# Altium schematic sheet StepperLogic.SchDoc
size B
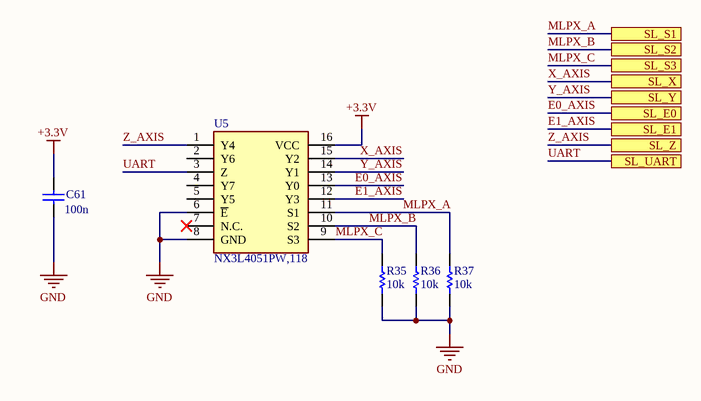
[diagram p0: StepperLogic.SchDoc]

## Parts
C61  value 100n  [RAD-0.3]  (hidden comment: X5R)
R35  value 10k  [AXIAL-0.3]  (hidden comment: Res1)
R36  value 10k  [AXIAL-0.3]  (hidden comment: Res1)
R37  value 10k  [AXIAL-0.3]  (hidden comment: Res1)
U5  NX3L4051PW,118  [SOP65P640X110-16N]

## Ports
SL_E0, SL_E1, SL_S1, SL_S2, SL_S3, SL_UART, SL_X, SL_Y, SL_Z

## Nets
+3.3V: C61.1 U5.16(VCC)
GND: C61.2 R35.1 R36.1 R37.1 U5.6(~{E}) U5.8(GND)
E0_AXIS: U5.13(Y0) ; port SL_E0
E1_AXIS: U5.12(Y3) ; port SL_E1
MLPX_A: R37.2 U5.11(S1) ; port SL_S1
MLPX_B: R36.2 U5.10(S2) ; port SL_S2
MLPX_C: R35.2 U5.9(S3) ; port SL_S3
UART: U5.3(Z) ; port SL_UART
X_AXIS: U5.15(Y2) ; port SL_X
Y_AXIS: U5.14(Y1) ; port SL_Y
Z_AXIS: U5.1(Y4) ; port SL_Z

Not connected (* = marked no-connect by the designer): U5 2(Y6) 4(Y7) 5(Y5) 7(N.C.)*

## Library data of the parts
C61 = Cap: Capacitor; Published: 8-Jun-2000; LatestRevisionDate: 17-Jul-2002; LatestRevisionNote: Re-released for DXP Platform.; PackageReference: RAD-0.3; Publisher: Altium Limited; PackageDescription: Radial Cap, Thru-Hole; 2 Leads; 0.3 in Pin Spacing
R35-R37 = Res1: Resistor; Published: 8-Jun-2000; LatestRevisionDate: 17-Jul-2002; LatestRevisionNote: Re-released for DXP Platform.; PackageReference: AXIAL-0.3; Publisher: Altium Limited; PackageDescription: Axial Device, Thru-Hole; 2 Leads; 0.3 in Pin Spacing
U5 = NX3L4051PW,118: Integrated Circuit; Manufacturer_Name: NXP; Datasheet Link: http://www.nxp.com/docs/en/data-sheet/NX3L4051.pdf; Height: 1.1mm; Manufacturer_Part_Number: NX3L4051PW,118; Mouser Part Number: 771-NX3L4051PW118; Mouser Price/Stock: https://www.mouser.co.uk/ProductDetail/NXP-Semiconductors/NX3L4051PW118?qs=vbj%2FKoHZRAgFepmnkfH0Pw%3D%3D; Arrow Part Number: NX3L4051PW,118; Arrow Price/Stock: https://www.arrow.com/en/products/nx3l4051pw118/nxp-semiconductors?region=nac